# EAGLE design tomato-single-cell (EAGLE 7.4.0)
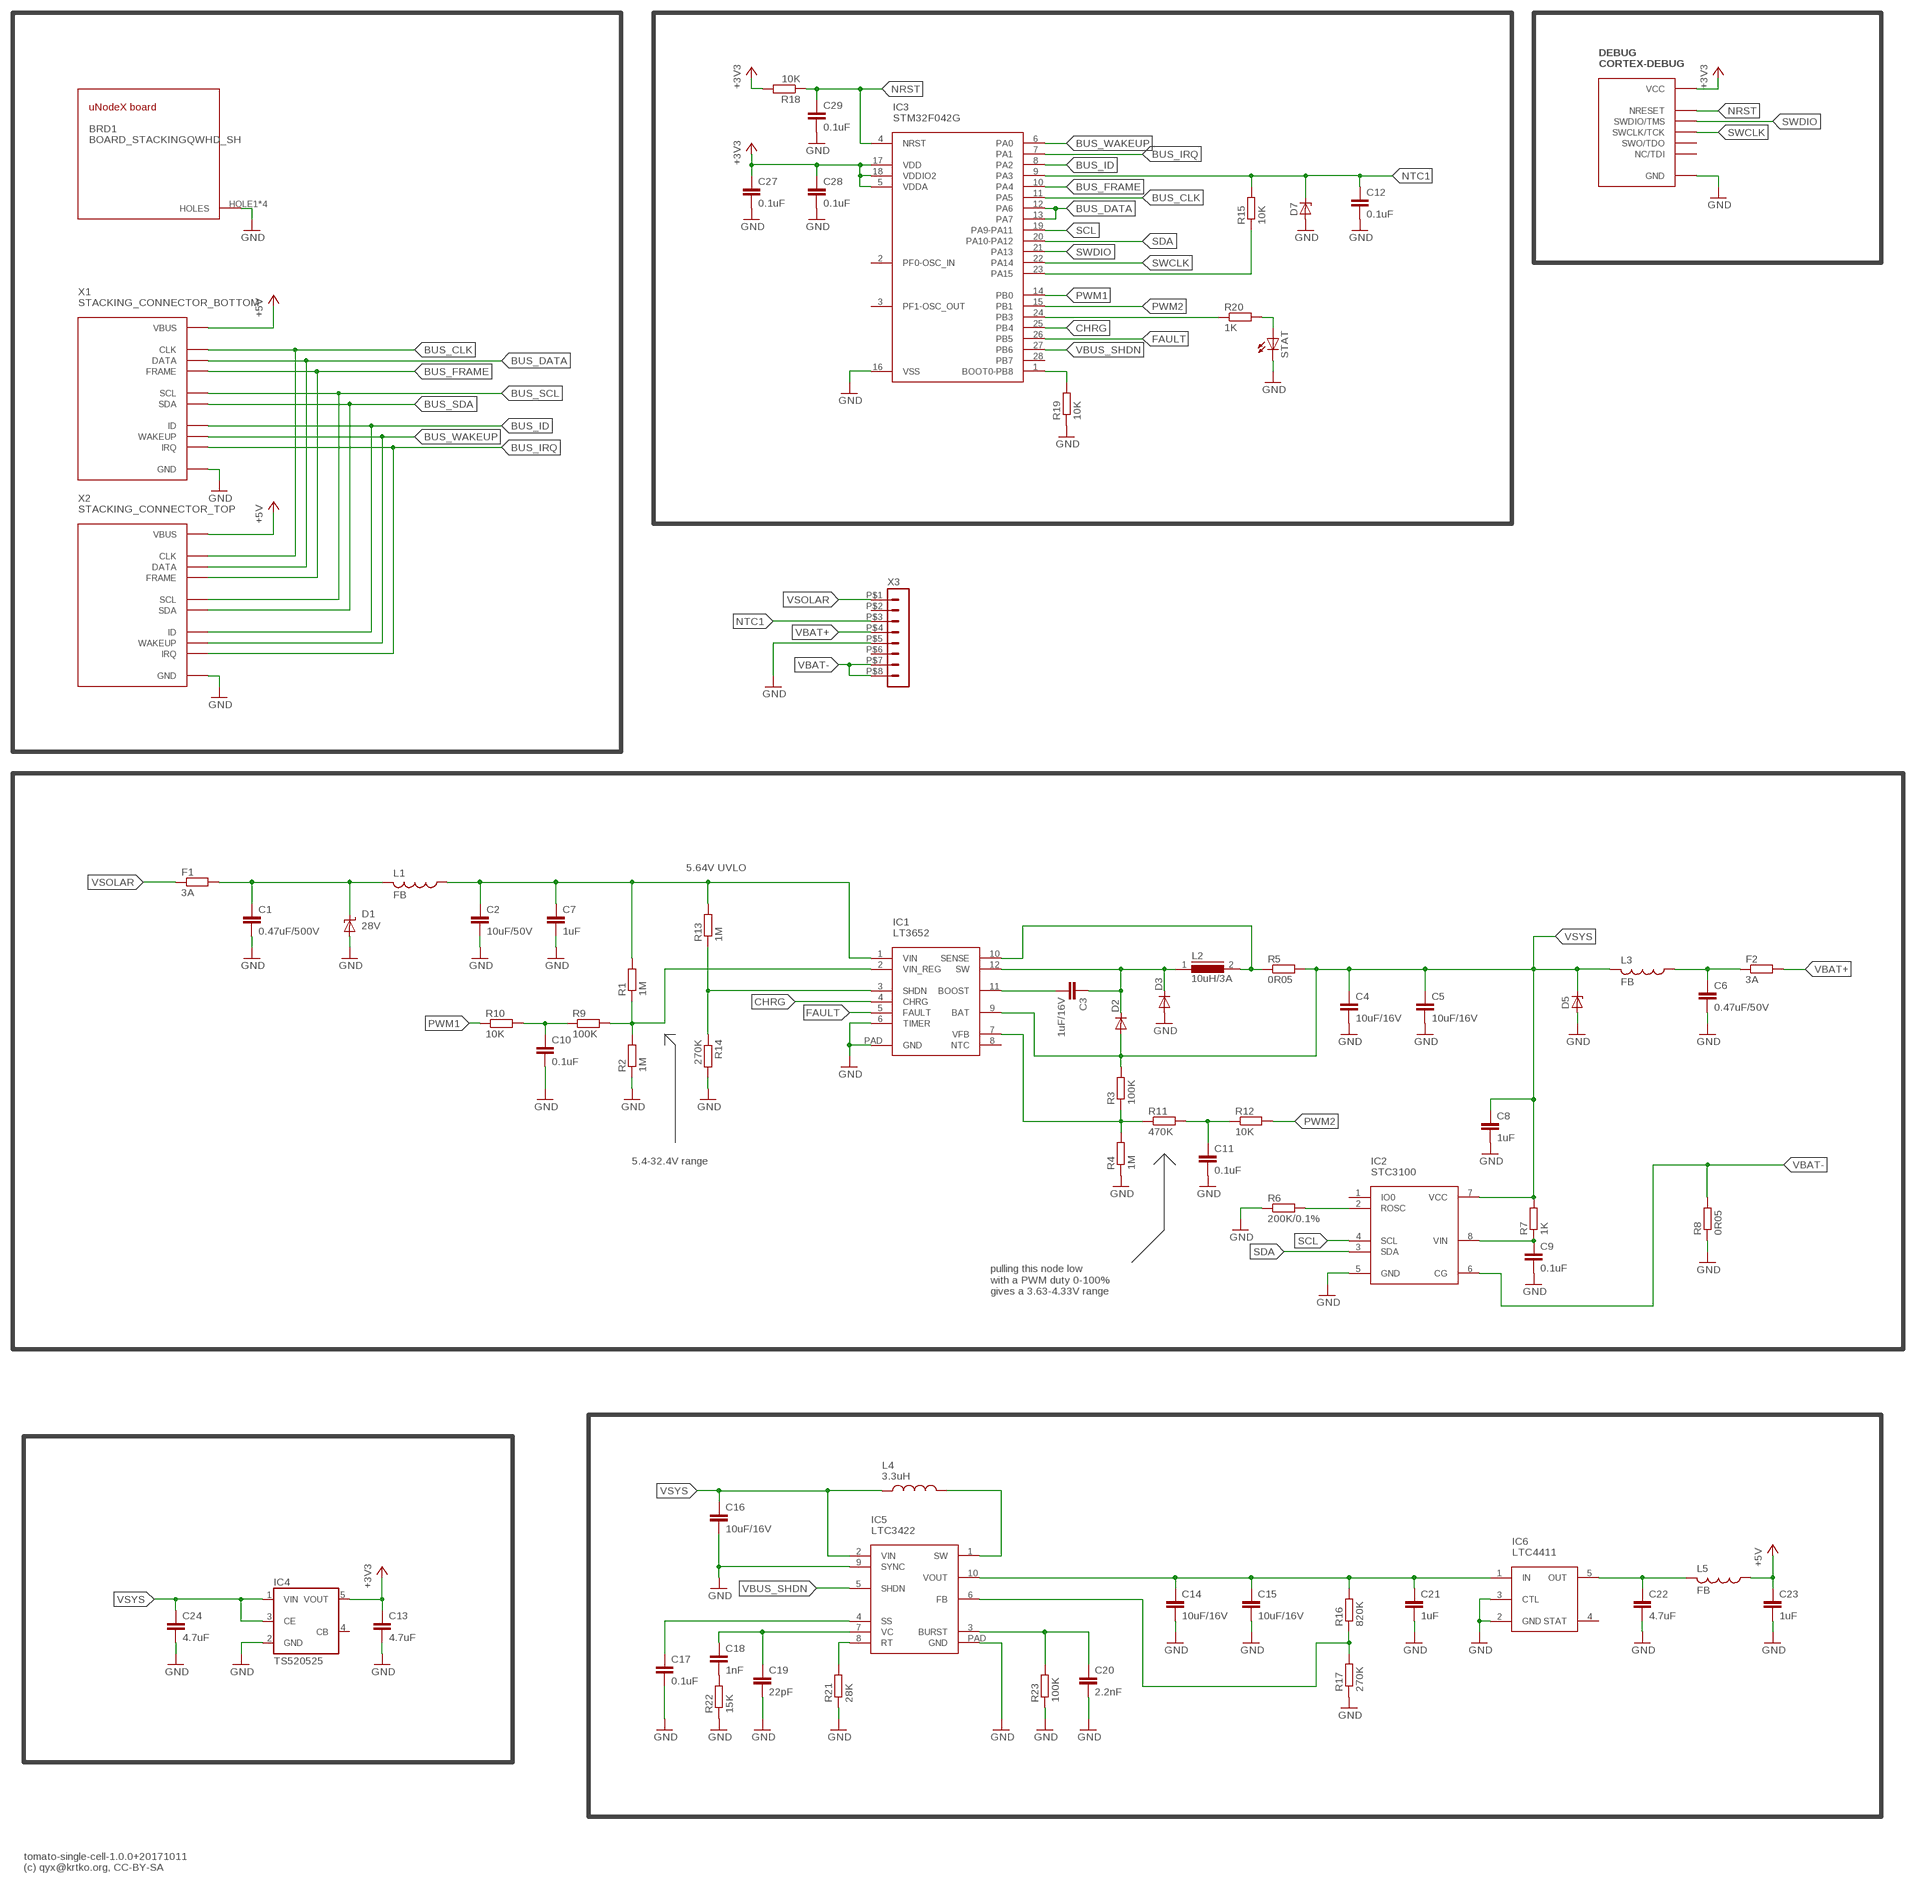
[diagram p0: schematic, sheet 1]

## Parts
BRD1  BOARD_STACKINGQWHD_SH  [QWHD_SHARP_CORNERS]
C1  0.47uF/500V  C-EUC1206  [C1206]
C2  10uF/50V  C-EUC2220K  [C2220K]
C3  1uF/16V  C-EUC0805  [C0805]
C4  10uF/16V  C-EUC1206  [C1206]
C5  10uF/16V  C-EUC1206  [C1206]
C6  0.47uF/50V  C-EUC0805  [C0805]
C7  1uF  C-EUC0805  [C0805]
C8  1uF  C-EUC0603  [C0603]
C9  0.1uF  C-EUC0603  [C0603]
C10  0.1uF  C-EUC0603  [C0603]
C11  0.1uF  C-EUC0603  [C0603]
C12  0.1uF  C-EUC0603  [C0603]
C13  4.7uF  C-EUC0805  [C0805]
C14  10uF/16V  C-EUC1206  [C1206]
C15  10uF/16V  C-EUC1206  [C1206]
C16  10uF/16V  C-EUC1206  [C1206]
C17  0.1uF  C-EUC0603  [C0603]
C18  1nF  C-EUC0603  [C0603]
C19  22pF  C-EUC0603  [C0603]
C20  2.2nF  C-EUC0603  [C0603]
C21  1uF  C-EUC0805  [C0805]
C22  4.7uF  C-EUC0805  [C0805]
C23  1uF  C-EUC0805  [C0805]
C24  4.7uF  C-EUC0805  [C0805]
C27  0.1uF  C-EUC0603  [C0603]
C28  0.1uF  C-EUC0603  [C0603]
C29  0.1uF  C-EUC0603  [C0603]
D1  28V  SUPPRESSOR-SMBJ  [SMBJ]
D2  DIODE-SOD323-W  [SOD323-W]
D3  DIODE-SOD323-W  [SOD323-W]
D5  ZENER-DIODESOT23  [SOT23]
D7  ZENER-DIODESOT23  [SOT23]
DEBUG  CORTEX-DEBUG  [CORTEX-DEBUG]
F1  3A  R-EU_R1206  [R1206]
F2  3A  R-EU_R1206  [R1206]
IC1  LT3652  [MSOP12-PAD]
IC2  STC3100  [MSOP8]
IC3  STM32F042G  [UFQFPN28]
IC4  TS520525  [SOT25]
IC5  LTC3422  [DFN10-3X3]
IC6  LTC4411  [SOT23-5]
L1  FB  L-USL3216C  [L3216C]
L2  10uH/3A  DR74  [DR74]
L3  FB  L-USL3216C  [L3216C]
L4  3.3uH  XAL50XX  [XAL50XX]
L5  FB  L-USL3216C  [L3216C]
R1  1M  R-EU_R0603  [R0603]
R2  1M  R-EU_R0603  [R0603]
R3  100K  R-EU_R0603  [R0603]
R4  1M  R-EU_R0603  [R0603]
R5  0R05  R-EU_R1206  [R1206]
R6  200K/0.1%  R-EU_R0603  [R0603]
R7  1K  R-EU_R0603  [R0603]
R8  0R05  R-EU_R1206  [R1206]
R9  100K  R-EU_R0603  [R0603]
R10  10K  R-EU_R0603  [R0603]
R11  470K  R-EU_R0603  [R0603]
R12  10K  R-EU_R0603  [R0603]
R13  1M  R-EU_R0603  [R0603]
R14  270K  R-EU_R0603  [R0603]
R15  10K  R-EU_R0603  [R0603]
R16  820K  R-EU_R0603  [R0603]
R17  270K  R-EU_R0603  [R0603]
R18  10K  R-EU_R0603  [R0603]
R19  10K  R-EU_R0603  [R0603]
R20  1K  R-EU_R0603  [R0603]
R21  28K  R-EU_R0603  [R0603]
R22  15K  R-EU_R0603  [R0603]
R23  100K  R-EU_R0603  [R0603]
STAT  LEDCHIPLED_0805  [CHIPLED_0805]
X1  STACKING_CONNECTOR_BOTTOM  [HAR-FLEX-BOTTOM-12P]
X2  STACKING_CONNECTOR_TOP  [HAR-FLEX-TOP-12P]
X3  HEADER_POS8_43045-0800  [43045-0800]

## Nets
+3V3: C13.1 C27.1 C28.1 DEBUG.VCC IC3.5(VDDA) IC3.17(VDD) IC3.18(VDDIO2) IC4.5(VOUT) R18.2
+5V: C23.1 L5.1 X1.VBUS X2.VBUS
BUS_CLK: IC3.11(PA5) X1.CLK X2.CLK
BUS_DATA: IC3.12(PA6) IC3.13(PA7) X1.DATA X2.DATA
BUS_FRAME: IC3.10(PA4) X1.FRAME X2.FRAME
BUS_ID: IC3.8(PA2) X1.ID X2.ID
BUS_IRQ: IC3.7(PA1) X1.IRQ X2.IRQ
BUS_SCL: X1.SCL X2.SCL
BUS_SDA: X1.SDA X2.SDA
BUS_WAKEUP: IC3.6(PA0) X1.WAKEUP X2.WAKEUP
CHRG: IC1.4(CHRG) IC3.25(PB4)
FAULT: IC1.5(FAULT) IC3.26(PB5)
GND: BRD1.HOLE1(HOLES) BRD1.HOLE2(HOLES) BRD1.HOLE3(HOLES) BRD1.HOLE4(HOLES) C1.2 C2.2 C4.2 C5.2 C6.2 C7.2 C8.2 C9.2 C10.2 C11.2 C12.2 C13.2 C14.2 C15.2 C16.2 C17.2 C19.2 C20.2 C21.2 C22.2 C23.2 C24.2 C27.2 C28.2 C29.2 D1.A D3.A D5.1(A) D7.1(A) DEBUG.GND1(GND) DEBUG.GND2(GND) DEBUG.GND_DETECT(GND) IC1.6(TIMER) IC1.PAD(GND) IC2.5(GND) IC3.16(VSS) IC4.2(GND) IC5.9(SYNC) IC5.PAD(GND) IC6.2(GND) IC6.3(CTL) R2.1 R4.1 R6.1 R8.1 R14.2 R17.1 R19.1 R21.1 R22.1 R23.1 STAT.C X1.GND1(GND) X1.GND2(GND) X1.GND3(GND) X1.H1(GND) X1.H2(GND) X1.H3(GND) X1.H4(GND) X2.GND1(GND) X2.GND2(GND) X2.GND3(GND) X2.H1(GND) X2.H2(GND) X2.H3(GND) X2.H4(GND) X3.P$5
N$1: C1.1 D1.C F1.2 L1.2
N$2: IC2.2(ROSC) R6.2
N$3: IC1.2(VIN_REG) R1.1 R2.2 R9.2
N$4: C9.1 IC2.8(VIN) R7.1
N$5: C10.1 R9.1 R10.2
N$6: C11.1 R11.2 R12.1
N$7: IC1.3(SHDN) R13.1 R14.1
N$8: C3.1 D2.C D3.C IC1.12(SW) L2.1
N$9: C17.1 IC5.4(SS)
N$10: C3.2 IC1.11(BOOST)
N$11: IC1.10(SENSE) L2.2 R5.1
N$12: IC1.7(VFB) R3.1 R4.2 R11.1
N$13: IC3.23(PA15) R15.1
N$14: IC3.24(PB3) R20.1
N$15: IC5.1(SW) L4.2
N$16: C14.1 C15.1 C21.1 IC5.10(VOUT) IC6.1(IN) R16.2
N$17: IC5.6(FB) R16.1 R17.2
N$18: IC5.8(RT) R21.2
N$19: C18.2 R22.2
N$20: C18.1 C19.1 IC5.7(VC)
N$21: C20.1 IC5.3(BURST) R23.2
N$23: C22.1 IC6.5(OUT) L5.2
N$33: IC3.1(BOOT0-PB8) R19.2
N$34: R20.2 STAT.A
NRST: C29.1 DEBUG.NRESET IC3.4(NRST) R18.1
NTC1: C12.1 D7.3(C) IC3.9(PA3) R15.2 X3.P$3
PWM1: IC3.14(PB0) R10.1
PWM2: IC3.15(PB1) R12.2
SCL: IC2.4(SCL) IC3.19(PA9-PA11)
SDA: IC2.3(SDA) IC3.20(PA10-PA12)
SWCLK: DEBUG.SWCLK/TCK IC3.22(PA14)
SWDIO: DEBUG.SWDIO/TMS IC3.21(PA13)
VBAT+: F2.2 X3.P$4
VBAT+PO: C6.1 F2.1 L3.1
VBAT-: IC2.6(CG) R8.2 X3.P$7 X3.P$8
VBUS_SHDN: IC3.27(PB6) IC5.5(SHDN)
VIN: C2.1 C7.1 IC1.1(VIN) L1.1 R1.2 R13.2
VSOLAR: F1.1 X3.P$1
VSYS: C4.1 C5.1 C8.1 C16.1 C24.1 D2.A D5.3(C) IC1.9(BAT) IC2.7(VCC) IC4.1(VIN) IC4.3(CE) IC5.2(VIN) L3.2 L4.1 R3.2 R5.2 R7.2
Unconnected: DEBUG.NC/TDI DEBUG.SWO/TDO IC1.8(NTC) IC2.1(IO0) IC3.2(PF0-OSC_IN) IC3.3(PF1-OSC_OUT) IC3.28(PB7) IC4.4(CB) IC6.4(STAT) X3.P$2 X3.P$6

## Notes on the sheet
- 5.64V UVLO
- 5.4-32.4V range
- pulling this node low
  with a PWM duty 0-100%
  gives a 3.63-4.33V range
- tomato-single-cell-1.0.0+20171011
- (c) qyx@krtko.org, CC-BY-SA

## Library data of the parts
BRD1 = unodex-boards:BOARD_STACKING
C1-C24 C27-C29 = rcl:C-EU: CAPACITOR, European symbol
D1 = diode:SUPPRESSOR-: Suppressor diode
D2 D3 = diode:DIODE-: DIODE
D5 D7 = diode:ZENER-DIODE: Z-Diode
DEBUG = debug-connectors:CORTEX-DEBUG
F1 F2 R1-R23 = rcl:R-EU_: RESISTOR, European symbol
IC1 = chargers:LT3652
IC2 = stc3100:STC3100
IC3 = stm32f042xx:STM32F042G
IC4 = v-reg:TS5205: 150mA Low Noise LDO Voltage Regulator with Enable TSC [Taiwan Semiconductor Company, Ltd] Source: http://www.taiwansemi.com .. 5205_0409c.pdf
IC5 = dc-dc-regulators:LTC3422
IC6 = ideal-diodes:LTC4411
L1 L3 L5 = rcl:L-US: INDUCTOR, American symbol
L2 = inductors:DR74: High Power Density, High Efficiency, Shielded Inductors Source: coiltronics_dr_series.pdf
L4 = smd-inductors:XAL50XX
STAT = led:LED: LED OSRAM: - CHIPLED LG R971, LG N971, LY N971, LG Q971, LY Q971, LO R971, LY R971 LH N974, LH R974 LS Q976, LO Q976, LY Q976 LO Q996 - Hyper CHIPLED LW Q18S LB Q993, LB Q99A, LB R99A - SideLED LS A670, LO A670, LY A670, LG A670, LP A670 LB A673, LV A673, LT A673, LW A673 LH A674 LY A675 LS A676, LA A676, LO A676, LY A676, LW A676 LS A679, LY A679, LG A679 - Hyper Micro SIDELED® LS Y876, LA Y876, LO Y876, LY Y876 LT Y87S - SmartLED LW L88C, LW L88S LB L89C, LB L89S, LG L890 LS L89K, LO L89K, LY L89K LS L896, LA L896, LO L896, LY L896 - TOPLED LS T670, LO T670, LY T670, LG T670, LP T670 LSG T670, LSP T670, LSY T670, LOP T670, LYG T670 LG T671, LOG T671, LSG T671 LB T673, LV T673, LT T673, LW T673 LH T674 LS T676, LA T676, LO T676, LY T676, LB T676, LH T676, LSB T676, LW T676 LB T67C, LV T67C, LT T67C, LS T67K, LO T67K, LY T67K, LW E67C LS E67B, LA E67B, LO E67B, LY E67B, LB E67C, LV E67C, LT E67C LW T67C LS T679, LY T679, LG T679 LS T770, LO T770, LY T770, LG T770, LP T770 LB T773, LV T773, LT T773, LW T773 LH T774 LS E675, LA E675, LY E675, LS T675 LS T776, LA T776, LO T776, LY T776, LB T776 LHGB T686 LT T68C, LB T68C - Hyper Mini TOPLED® LB M676 - Mini TOPLED Santana® LG M470 LS M47K, LO M47K, LY M47K Source: http://www.osram.convergy.de LUXEON: - LUMILED® LXK2-PW12-R00, LXK2-PW12-S00, LXK2-PW14-U00, LXK2-PW14-V00 LXK2-PM12-R00, LXK2-PM12-S00, LXK2-PM14-U00 LXK2-PE12-Q00, LXK2-PE12-R00, LXK2-PE12-S00, LXK2-PE14-T00, LXK2-PE14-U00 LXK2-PB12-K00, LXK2-PB12-L00, LXK2-PB12-M00, LXK2-PB14-N00, LXK2-PB14-P00, LXK2-PB14-Q00 LXK2-PR12-L00, LXK2-PR12-M00, LXK2-PR14-Q00, LXK2-PR14-R00 LXK2-PD12-Q00, LXK2-PD12-R00, LXK2-PD12-S00 LXK2-PH12-R00, LXK2-PH12-S00 LXK2-PL12-P00, LXK2-PL12-Q00, LXK2-PL12-R00 Source: www.luxeon.com KINGBRIGHT: KA-3528ASYC Source: www.kingbright.com
X1 = unodex-boards:STACKING_CONNECTOR_BOTTOM
X2 = unodex-boards:STACKING_CONNECTOR_TOP
X3 = con-molex-micro-fit-3_0:HEADER_POS8_?: Molex - Micro-Fit 3.0 Series connector, 3.00mm (0.118") pitch header, 8 positions.

## Net classes
0 default: width 0.2 mm, drill 0.3 mm, clearance 0.15 mm

## Board
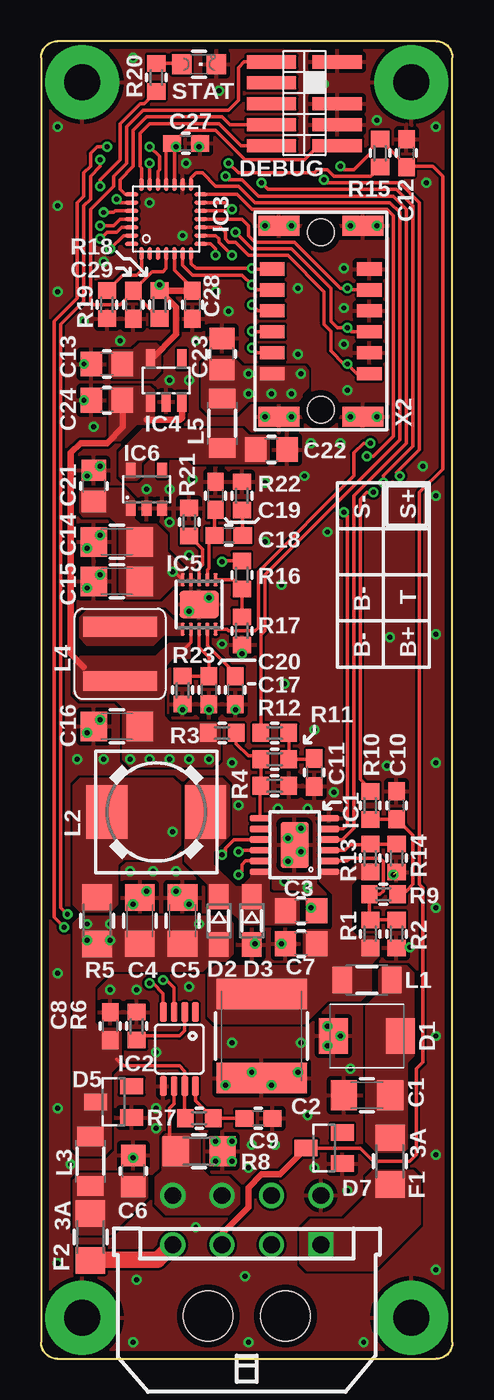
[diagram p1: board, top side]
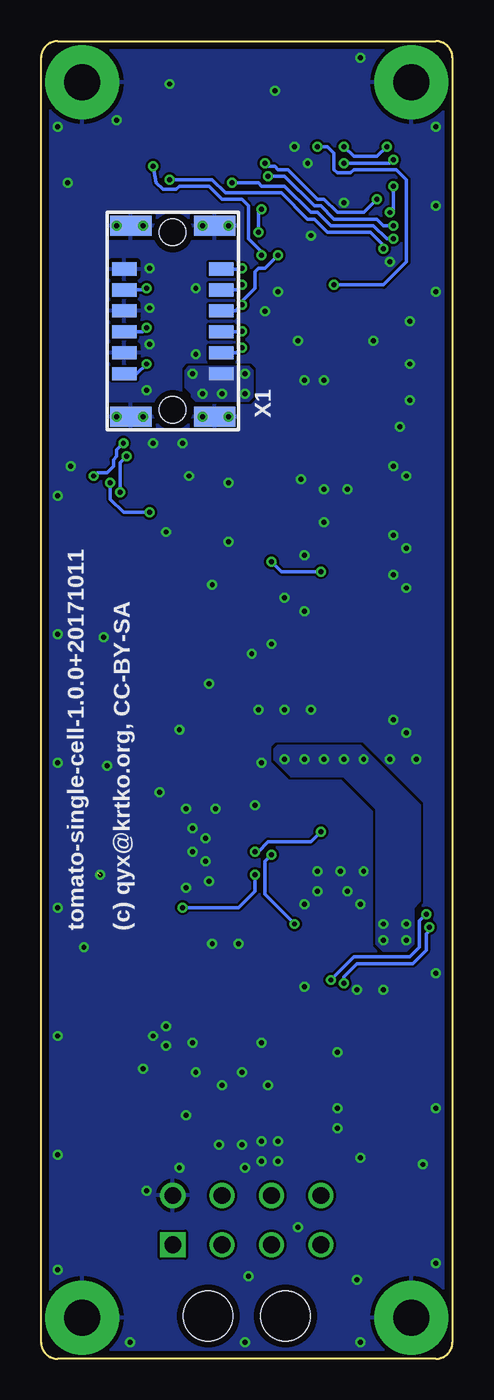
[diagram p2: board, bottom side, seen from below]

Size 25 x 80 mm. Coordinates in mm from the lower left corner, seen from the top.
Copper layers (1*16): Top 0.035mm / dielectric 1.5mm / Bottom 0.035mm
Design rules "seeed *": minimum track width 0.2mm, minimum drill 0.3mm, track to track 0.15mm, track to pad 0.15mm, pad to pad 0.15mm, via to via 0.15mm, smd to smd 0mil, copper to edge 0.4mm, drill to drill 0.4mm, minimum pad ring 6mil, minimum via ring 6mil, stop-mask expansion 2mil, vias tented up to drill 0.5mm, thermal gap 10mil

### Footprints (pad centres in the part's own frame; a part is rotated, then mirrored left to right if it is on the bottom)
QWHD_SHARP_CORNERS = drill 2.2 pad 4.5: HOLE1 2.5,2.5; HOLE2 22.5,2.5; HOLE3 22.5,77.5; HOLE4 2.5,77.5
C1206 = smd 1.6 x 1.8: 1 -1.4,0; 2 1.4,0
C2220K = smd 1.85 x 5.5: 1 -2.55,0; 2 2.55,0
C0805 = smd 1.3 x 1.5: 1 -0.95,0; 2 0.95,0
C0603 = smd 1.1 x 1: 1 -0.85,0; 2 0.85,0
SMBJ = smd 1.78 x 2.16: A 2.04,0; C -2.03,0
SOD323-W = smd 1.5 x 1.2: A 1.45,0; C -1.45,0
SOT23 = smd 1 x 1.4: 1 -0.95,-1.1; 2 0.95,-1.1; 3 0,1.1
CORTEX-DEBUG = smd 0.8 x 3: GND1 -1.27,-2; GND2 0,-2; GND_DETECT 2.54,-2; NC/TDI 1.27,2; NRESET 2.54,2; SWCLK/TCK -1.27,2; SWDIO/TMS -2.54,2; SWO/TDO 0,2; VCC -2.54,-2
R1206 = smd 1.6 x 1.803: 1 -1.422,0; 2 1.422,0
MSOP12-PAD = smd 0.4 x 1.2: 1 -1.625,-2.1; 2 -0.975,-2.1; 3 -0.325,-2.1; 4 0.325,-2.1; 5 0.975,-2.1; 6 1.625,-2.1; 7 1.625,2.1; 8 0.975,2.1; 9 0.325,2.1; 10 -0.325,2.1; 11 -0.975,2.1; 12 -1.625,2.1 | smd 2.8 x 1.7: PAD 0,0
MSOP8 = smd 0.4 x 1.2: 1 -0.975,-2.25; 2 -0.325,-2.25; 3 0.325,-2.25; 4 0.975,-2.25; 5 0.975,2.25; 6 0.325,2.25; 7 -0.325,2.25; 8 -0.975,2.25
UFQFPN28 = smd 0.8 x 0.25: 1 -2.1,1.5; 2 -2.1,1; 3 -2.1,0.5; 4 -2.1,0; 5 -2.1,-0.5; 6 -2.1,-1; 7 -2.1,-1.5; 15 2.1,-1.5; 16 2.1,-1; 17 2.1,-0.5; 18 2.1,0; 19 2.1,0.5; 20 2.1,1; 21 2.1,1.5 | smd 0.25 x 0.8: 8 -1.5,-2.1; 9 -1,-2.1; 10 -0.5,-2.1; 11 0,-2.1; 12 0.5,-2.1; 13 1,-2.1; 14 1.5,-2.1; 22 1.5,2.1; 23 1,2.1; 24 0.5,2.1; 25 0,2.1; 26 -0.5,2.1; 27 -1,2.1; 28 -1.5,2.1
SOT25 = smd 0.55 x 1.2: 1 -0.95,-1.3; 2 0,-1.3; 3 0.95,-1.3; 4 0.95,1.3; 5 -0.95,1.3
DFN10-3X3 = smd 0.25 x 0.8: 1 -1,-1.5; 2 -0.5,-1.5; 3 0,-1.5; 4 0.5,-1.5; 5 1,-1.5; 6 1,1.5; 7 0.5,1.5; 8 0,1.5; 9 -0.5,1.5; 10 -1,1.5 | smd 2.38 x 1.65: PAD 0,0
SOT23-5 = smd 0.6 x 0.9: 1 -0.95,-1.15; 2 0,-1.15; 3 0.95,-1.15; 4 0.95,1.15; 5 -0.95,1.15
L3216C = smd 1.2 x 1.6: 1 -1.5,0; 2 1.5,0
DR74 = smd 2.5 x 3.25: 1 -3,0; 2 3,0
XAL50XX = smd 1.2 x 4.5: 1 -1.65,0; 2 1.65,0
R0603 = smd 1 x 1.1: 1 -0.85,0; 2 0.85,0
CHIPLED_0805 = smd 1.2 x 1.2: A 0,-1.05; C 0,1.05
HAR-FLEX-BOTTOM-12P = smd 1.5 x 0.8 bottom: CLK -5.05,-15.105; DATA -5.05,-17.645; FRAME -5.05,-20.185; GND1 -5.05,-13.835; GND2 -5.05,-16.375; GND3 -5.05,-18.915; ID -10.95,-16.375; IRQ -10.95,-13.835; SCL -10.95,-17.645; SDA -10.95,-18.915; VBUS -10.95,-20.185; WAKEUP -10.95,-15.105 | smd 2.5 x 1.2 bottom: H1 -10.55,-22.8; H2 -5.45,-22.8; H3 -5.45,-11.2; H4 -10.55,-11.2 | hole 1.6: -8,-11.615; -8,-22.385
HAR-FLEX-TOP-12P = smd 1.5 x 0.8: CLK -5.05,-15.105; DATA -5.05,-17.645; FRAME -5.05,-20.185; GND1 -5.05,-13.835; GND2 -5.05,-16.375; GND3 -5.05,-18.915; ID -10.95,-16.375; IRQ -10.95,-13.835; SCL -10.95,-17.645; SDA -10.95,-18.915; VBUS -10.95,-20.185; WAKEUP -10.95,-15.105 | smd 2.5 x 1.2: H1 -10.55,-22.8; H2 -5.45,-22.8; H3 -5.45,-11.2; H4 -10.55,-11.2 | hole 1.6: -8,-11.615; -8,-22.385
43045-0800 = drill 1.02 square: P$1 4.5,4.32 | drill 1.02: P$2 1.5,4.32; P$3 -1.5,4.32; P$4 -4.5,4.32; P$5 4.5,7.32; P$6 1.5,7.32; P$7 -1.5,7.32; P$8 -4.5,7.32 | hole 3: 2.35,0; -2.35,0

### Placement (x,y rotation side)
BRD1  0,0 0 top
C1  19.8,16 180 top
C2  13.4,19.6 270 top
C3  15.8,27.2 0 top
C4  6,26.6 90 top
C5  8.6,26.6 90 top
C6  5.6,11.4 90 top
C7  15.8,25.2 180 top
C8  4.2,20.2 90 top
C9  13.2,14.6 0 top
C10  21.6,33.6 90 top
C11  16.6,35.6 270 top
C12  22.2,73.2 90 top
C13  4,60.4 180 top
C14  4.6,49.6 180 top
C15  4.6,47.2 180 top
C16  4.6,38.4 180 top
C17  11.8,40.6 270 top
C18  11.4,50 0 top
C19  10.6,52.4 90 top
C20  10.2,40.6 270 top
C21  3.2,53 90 top
C22  14,55.2 0 top
C23  11,61 90 top
C24  4,58.2 180 top
C27  8.8,73.8 0 top
C28  9.2,64 270 top
C29  5.6,64 270 top
D1  19.8,19.6 180 top
D2  10.8,26.6 270 top
D3  12.8,26.6 270 top
D5  4.4,15.6 90 top
D7  17.2,12.8 90 top
DEBUG  16,76.2 90 top
F1  21.2,12 90 top
F2  3,7.4 270 top
IC1  15.4,31.2 90 top
IC2  8.4,18.8 180 top
IC3  7.6,69.2 90 top
IC4  7.6,59.4 0 top
IC5  9.6,45.8 0 top
IC6  6.4,52.8 0 top
L1  19.8,23 0 top
L2  7,33.2 180 top
L3  3,12 90 top
L4  4.8,42.8 90 top
L5  11,56.8 270 top
R1  20,25.8 270 top
R2  21.6,25.8 90 top
R3  11,38 180 top
R4  14.2,34.8 180 top
R5  3.4,26.6 270 top
R6  5.8,20.2 270 top
R7  9.6,14.6 180 top
R8  9.6,12.6 180 top
R9  20.8,28.2 180 top
R10  20,33.6 270 top
R11  14.2,36.4 0 top
R12  14.2,38 180 top
R13  20,30.4 270 top
R14  21.6,30.4 270 top
R15  20.6,73.2 90 top
R16  12.2,47.6 90 top
R17  12.2,44.2 90 top
R18  7.2,64 90 top
R19  4,64 90 top
R20  7,77.8 90 top
R21  9,50.8 270 top
R22  12.2,52.4 270 top
R23  8.6,40.6 90 top
STAT  9.6,78.6 270 top
X1  25,80 0 top
X2  25,80 0 top
X3  12.5,2.6 0 top

### Tracks (layer width: path | path; a pad name or v marks a point on that pad's centre or on a via)
+3V3  (via drill 0.3)
  Top 0.2: IC3.5 8.1,66.1 9.2,65 C28.1 | IC3.18 7.6,73.45 C27.1 | IC3.17 8.1,73.65 | 8.1,73.65 C27.1 | C27.1 8,73.8 8.8,74.6 10.6,74.6 12.4,72.8 16,72.8 16.86,73.66 DEBUG.VCC | 8.1,73.65 8.15,73.65 v8.2,73.6 | v7.2,65.2 R18.2
  Top 0.4: IC4.5 6.7,60.7 8.2,62.2 8.2,63.85 R18.2 C28.1
  Bottom 0.2: v8.2,73.6 7.6,73.6 7.2,73.2 7.2,72.2 7,72 6.2,72 6,72.2 3.4,72.2 2.8,71.6 2.8,66.6 4.2,65.2 v7.2,65.2
  pour Top (no thermals): 4.4,61.2 5.6,61.2 6,61.6 7,61.6 7.2,61.4 7.2,60 6.8,59.6 4.4,59.6 4.2,59.8 4.2,61
+5V  (via drill 0.3)
  other vias: 12.6,59.8 12.6,58.6 15.8,59.8 15.2,58.6 14,58.6
  pour Top (no thermals): 12.2,60.2 16,60.2 16.2,60 16.2,59 15.8,58.6 15.8,58.4 15.6,58.2 12.6,58.2 11.8,57.4 10.2,57.4 9.8,57.8 9.8,60.4 10.2,60.8 11.6,60.8
  pour Bottom (no thermals): 12.4,60.2 16,60.2 16.2,60 16.2,59 15.8,58.6 15.8,58.4 15.6,58.2 12.4,58.2 12.2,58.4 12.2,60
BUS_CLK  (via drill 0.3)
  Top 0.2: X2.CLK 18.7,64.89 v18.6,65 18.2,65 15.4,67.8 13,67.8 12.6,68.2 12.6,68.8 12.2,69.2 IC3.11
  Bottom 0.2: X2.CLK 18.7,64.89 v18.6,65
BUS_DATA  (via drill 0.3)
  Top 0.2: X2.DATA 18.84,62.35 v18.6,62.6 18,62.6 17.6,63 17.6,65 15.2,67.4 12.8,67.4 v11.8,68.4 | IC3.12 11.5,69.7 v11.6,69.8 11.2,70.2 IC3.13
  Bottom 0.2: X2.DATA 18.84,62.35 v18.6,62.6 | v11.8,68.4 11.8,69.6 v11.6,69.8
BUS_FRAME  (via drill 0.3)
  Top 0.2: X2.FRAME 19.18,59.81 v18.6,60.4 18.4,60.4 17.6,61.2 17.6,62.4 17.2,62.8 17.2,64.8 15,67 12.6,67 11.8,67.8 11.4,67.8 11.2,68 11.2,68.4 10.9,68.7 IC3.10
  Bottom 0.2: X2.FRAME 19.18,59.81 v18.6,60.4
BUS_ID  (via drill 0.3)
  Top 0.2: X2.ID 13.18,63.62 v12.8,64 | IC3.8 10.3,67.7 10.6,67.4 v10.6,67
  Bottom 0.2: X2.ID 13.18,63.62 v12.8,64 12.8,64.2 12,65 12,66 11.8,66.2 11.4,66.2 v10.6,67
BUS_IRQ  (via drill 0.3)
  Top 0.2: X2.IRQ 12.84,66.17 v12.8,66.2 9.4,66.2 9.1,66.5 IC3.7
  Bottom 0.2: X2.IRQ 12.84,66.17 v12.8,66.2
BUS_SCL  (via drill 0.3)
  Top 0.2: X2.SCL 12.85,62.35 v12.8,62.4
  Bottom 0.2: X2.SCL 12.85,62.35 v12.8,62.4
BUS_SDA  (via drill 0.3)
  Top 0.2: X2.SDA 13.12,61.09 v12.8,61.4
  Bottom 0.2: X2.SDA 13.12,61.09 v12.8,61.4
BUS_WAKEUP  (via drill 0.3)
  Top 0.2: X2.WAKEUP 13.11,64.89 v12.8,65.2 12.2,65.8 9.2,65.8 8.6,66.4 IC3.6
  Bottom 0.2: X2.WAKEUP 13.11,64.89 v12.8,65.2
CHRG  (via drill 0.3)
  Top 0.2: IC1.4 18.32,31.52 19,32.2 19,52.4 22.2,55.6 22.2,69.8 21.4,70.6 13.2,70.6 12.2,71.6 11.4,71.6 v11.2,71.8 | IC3.25 4.8,69.2 4.4,68.8 v3.6,68.8
  Bottom 0.2: v11.2,71.8 10.2,71.8 8.4,70 8,70 7.2,69.2 4.6,69.2 4.2,68.8 v3.6,68.8
FAULT  (via drill 0.3)
  Top 0.2: IC1.5 18.38,32.17 18.6,32.4 18.6,51.2 v18.4,51.4 | IC3.26 4.9,68.7 4.6,68.4 4,68.4 v3.6,68 | v13.4,71.4 13.8,71 21.6,71 22.6,70 22.6,55.4 20.8,53.6 v20.8,53.2
  Bottom 0.2: v13.4,71.4 11.8,71.4 11.6,71.2 10.2,71.2 8.6,69.6 8.2,69.6 7.4,68.8 4.8,68.8 4,68 v3.6,68 | v20.8,53.2 20.8,52.2 20,51.4 v18.4,51.4
GND  (via drill 0.3)  (1 unrouted)
  other vias: 5.6,1 12.6,1 19.6,1 1,5.8 24,5.4 24,12.4 24,19.6 1,15.2 1,23.4 24,27.4 24,36.2 24,44 24,52.4 2.6,58.2 1,64.8 1,74.8 24,74.8 15.2,68.8 13.6,68.8 18.8,68.8 20.4,68.8 15.2,57.2 13.6,57.2 18.8,57.2 20.4,57.2 21.4,29.4 18.4,66.2 18.4,63.8 18.4,61.6 8.8,72.6 9.6,73.6 10.8,77 17.2,77.4 20.4,75.2 3.8,66.6 2.6,63 4.8,61.8 9.4,61.8 10.6,64.8 11.4,63.6 5.6,79 15,30.2 15.8,30.8 15,31.6 15.8,32.2 14.4,33.4 16.2,33.4 17.8,34.4 18.6,10.2 12.6,11.6 12.8,13 14.2,13 16.2,14.8 11.2,16.6 12.8,17.4 14,16.6 15.6,17.4 7,18.6 7,14 7,15.2 5.8,4.8 1.8,11.8 9.4,8 12.4,5 17.4,20.2 18.2,19.6 17.4,19 18.8,17.6 11.6,19.2 15.8,19.2 14.6,25.2 13,25.2 9,22.6 4.2,22.4 5.8,22.4 5.6,27.6 6.4,28.4 8.2,28.4 9,27.6 5.4,29.6 6.8,29.6 8.2,29.6 8.6,39.4 10.2,39.4 11.8,39.4 12,33.6 11.6,36.2 16.6,38.2 14.8,41 21,36 3.8,36.4 2.8,38 3.6,50 2.8,49.2 3.6,47.6 2.8,46.8 9,45.4 10.2,46.2 9,48.8 7.8,50.8 6.4,52.8 7.8,52.8 9.2,53.4 13.6,53.2 16.4,55.6 16,53.6 2.8,53.6 3.6,54.2 7.8,59.4 9,59.4 3.2,56.6 3.6,38.8 2.2,36.4 2.6,60.4 1,70 11,43.4 12.2,42.8 14.8,29 16.2,28.6 22.4,25 18.6,58.8 15.6,61 15.6,65 18.2,55.6 8.6,68.2 6.6,70.2 23.4,71.4 23.2,54.2 21.2,43.8 13.6,49.6 17.4,50.2 14.6,47 16.6,11.6 5.6,12.2 10.6,12 10.6,13.2 11.6,13.2 11.6,12
  pour Top (rank 2): 0,0 25,0 25,80 0,80
  pour Bottom (rank 2): 0,0 25,0 25,80 0,80
N$1
  pour Top (no thermals): 22.2,14.4 22.2,18 22.6,18.4 22.6,23.4 22.2,23.8 20.8,23.8 20.6,23.6 20.6,22.2 19.8,21.4 19.8,13.2 20.4,12.6 22,12.6 22.2,12.8
N$2
  Top 0.2: IC2.2 8.72,19.93 8.4,19.6 6.05,19.6 R6.2
N$3
  Top 0.2: IC1.2 18.62,30.23 18.8,30.4 20.6,30.4 20.8,30.2 20.8,28.4 20.6,28.2 R9.2 19.95,26.7 R1.1 R2.2
N$4
  Top 0.2: IC2.8 9.38,15.68 R7.1 C9.1
N$5
  Top 0.2: R9.1 21.85,28.4 22.2,28.4 22.6,28.8 22.6,31.8 21.65,32.75 C10.1 R10.2
N$6
  Top 0.2: C11.1 16.55,36.4 R11.2 R12.1
N$7
  Top 0.2: IC1.3 18.48,30.88 18.8,31.2 19.95,31.2 R13.1 R14.1
N$8
  pour Top (no thermals): 13.8,28.4 13.8,29.6 12.8,29.6 12.8,29.2 12.2,28.6 11.8,28.6 10.4,30 10.4,30.8 11.4,31.8 11.4,34.8 11,35.2 9.2,35.2 8.8,34.8 8.8,30.2 10.2,28.8 10.2,27.6 10.4,27.4 11.4,27.4 12.4,26.4 15.4,26.4 15.6,26.6 15.6,28 15.4,28.2 14,28.2
N$9
  Top 0.2: IC5.4 10.1,43.3 11.8,41.6 C17.1
N$10  (via drill 0.3)
  Top 0.2: v16.4,27.4 16.55,27.2 C3.2 | IC1.11 12.43,30.23 12.2,30 12.2,29.6 v12,29.4
  Bottom 0.2: v12,29.4 12,28.4 13,27.4 v16.4,27.4
N$11  (via drill 0.3)
  Top 0.2: IC1.10 12.07,30.88 v12,30.8
  Bottom 0.2: v12,30.8 11.8,30.8 11.2,31.4 8.6,31.4 v8,32
  pour Top (no thermals): 2,29.6 2,27.6 2.4,27.2 4.2,27.2 4.6,27.6 4.6,30 5,30.4 7.6,30.4 8.4,31.2 8.4,34.8 8,35.2 2.4,35.2 2,34.8
N$12
  Top 0.2: R3.1 11.85,37.35 12.6,36.6 13.15,36.6 R11.1 R4.2 13.3,34.75 IC1.7
N$13  (via drill 0.3)
  Top 0.2: IC3.23 4.8,70.2 v4.6,70.4 | v11.4,72.6 12,72 16.6,72 16.8,72.2 17.4,72.2 17.8,71.8 20.05,71.8 R15.1
  Bottom 0.2: v4.6,70.4 5.4,69.6 7,69.6 7.8,70.4 8.2,70.4 10,72.2 10.6,72.2 10.8,72.4 11.2,72.4 v11.4,72.6
N$14  (via drill 0.3)
  Top 0.2: IC3.24 4.5,69.7 4.4,69.6 v3.8,69.6 | v3.6,71.2 3.6,71.6 4.8,72.8 4.8,75 6,76.2 6.25,76.2 R20.1
  Bottom 0.2: v3.8,69.6 3.6,69.8 v3.6,71.2
N$15
  pour Top (no thermals): 2.8,43.4 6.8,43.4 7.4,44 8.6,44 8.6,44.6 8.2,44.6 7.4,45.4 2.8,45.4 2.4,45 2.4,43.8
N$16  (via drill 0.3)
  Top 0.2: R16.2 11.05,48.45 v11,48.4 | v8,47.8 8.1,47.8 IC5.10
  Bottom 0.2: v11,48.4 10.4,47.8 v8,47.8
  pour Top (no thermals): 3.2,52.8 5,52.8 5.6,52.2 5.6,51 6,50.6 7,50.6 7.6,50 7.6,49 8.6,48 8.6,47 8,47 7.2,46.2 5.2,46.2 4.8,46.6 4.8,50.6 4.2,51.2 2.6,51.2 2.4,51.4 2.4,52.6 2.6,52.8
N$17
  Top 0.2: IC5.6 11.65,47.3 R16.1 R17.2
N$18
  Top 0.2: IC5.8 9.6,48 9.8,48.2 9.8,49.15 R21.2
N$19
  Top 0.2: C18.2 12.25,51.5 R22.2
N$20
  Top 0.2: IC5.7 10.1,47.9 10.2,48 10.2,49.65 C18.1 10.55,51.5 C19.1
N$21
  Top 0.2: IC5.3 9.6,43.2 10.2,42.6 C20.1 R23.2
N$23
  pour Top (no thermals): 7,54.8 9,54.8 9.4,54.4 13.6,54.4 13.8,54.6 13.8,55.8 13.6,56 12.6,56 12.2,56.4 6.2,56.4 4.8,55 4.8,53.6 5,53.4 5.8,53.4 6,53.6 6,54.4 6.4,54.8
N$33
  Top 0.2: IC3.1 6.1,66.1 5.8,65.8 4.95,65.8 R19.2
N$34
  Top 0.2: R20.2 8.5,78.65 STAT.A
NRST
  Top 0.2: C29.1 5.6,64.75 R18.1 | IC3.4 7.6,66.2 7.4,66 6.75,66 C29.1 | DEBUG.NRESET 12.34,78.74 12,78.4 12,76.4 11.4,75.8 6.2,75.8 5.2,74.8 5.2,72.6 4.4,71.8 4.4,71.2 3,69.8 3,64.2 3.2,64 4.8,64 5.6,64.8 C29.1
NTC1  (via drill 0.3)
  Top 0.2: IC3.9 10.6,68.2 10.8,68 10.8,67.8 v11.6,67 | D7.3 19.4,12.8 20.2,12 22.4,12 22.8,12.4 22.8,17.6 23.2,18 23.2,28.6 23,28.8 23,52.6 24.4,54 24.4,71.8 23.8,72.4 22.25,72.4 C12.1 22.2,72.45 R15.2 20,73.45 20,73.2 19,72.2 18.4,72.2 v18.2,72.4
  Top 0.4: X3.P$3 11,7.6 12.6,9.2 12.6,10.4 13.4,11.2 14.5,11.2 D7.3
  Bottom 0.2: v11.6,67 11.6,67.2 12.4,68 12.4,70 12.8,70.4 14,70.4 14.8,71.2 16.6,71.2 16.8,71 17.6,71 18,71.4 v18.2,72.4
PWM1  (via drill 0.3)
  Top 0.2: IC3.14 11.9,70.7 12.8,69.8 21,69.8 21.4,69.4 21.4,56 20.2,54.8 v19.8,54.8 | R10.1 20,34.6 19.4,35.2 19.4,52.2 19.8,52.6 v20.2,52.6
  Bottom 0.2: v20.2,52.6 20.2,54.4 v19.8,54.8
PWM2
  Top 0.2: IC3.15 9.1,71.7 9.4,72 9.8,72 10.6,71.2 12,71.2 13,70.2 21.2,70.2 21.8,69.6 21.8,55.8 13.6,47.6 13.6,44.2 13.35,43.95 R12.2
SCL  (via drill 0.3)
  Top 0.2: IC3.19 7.1,72.1 7.2,72.2 7.2,73 v6.6,73.6 | v4,73.6 3.4,73.6 3,73.2 3,72.4 2.6,72 2.6,70.6 2.2,70.2 2.2,64.4 0.8,63 0.8,26.8 v1.4,26.2 | IC2.4 7.42,22.18 6.8,22.8 v6.6,22.8
  Bottom 0.2: v6.6,73.6 6,73 4.6,73 v4,73.6 | v1.4,26.2 1.4,26 1.6,25.8 1.6,24.8 2.4,24 5.8,24 6.6,23.2 v6.6,22.8
SDA  (via drill 0.3)
  Top 0.2: IC3.20 v6.6,72.6 | v3.6,72.8 3.6,72.4 3,71.8 3,70.4 2.6,70 2.6,64.2 1.2,62.8 1.2,27.4 v1.6,27 | IC2.3 8.07,22.52 7.6,23 v7.4,23
  Bottom 0.2: v6.6,72.6 3.8,72.6 v3.6,72.8 | v1.6,27 2,26.6 2,25 2.6,24.4 6,24.4 v7.4,23
SWCLK
  Top 0.2: IC3.22 5.1,70.7 4.8,71 4.8,71.6 5.6,72.4 5.6,74.6 6.4,75.4 11,75.4 11.47,74.93 DEBUG.SWCLK/TCK
SWDIO
  Top 0.2: IC3.21 6.1,72.3 6,72.4 6,74.4 6.6,75 10.8,75 12.14,73.66 DEBUG.SWDIO/TMS
VBAT+
  Top 1: F2.2 3.02,6 7.08,6 X3.P$4
VBAT+PO
  pour Top (no thermals): 2,7.8 2.2,7.6 4.2,7.6 6.4,9.8 6.4,11 6.2,11.2 2.4,11.2 2,10.8
VBAT-
  Top 0.2: IC2.6 8.07,15.47 7.8,15.2 7.8,12.98 R8.2
  pour Top (no thermals): 7.6,13.6 9.4,13.6 9.6,13.4 9.6,11.6 10.2,11 11.4,11 12,10.4 12,9.4 11.4,8.8 7.6,8.8 7,9.4 7,11 7.4,11.4 7.4,13.4
VBUS_SHDN  (via drill 0.3)
  Top 0.2: IC5.5 11.3,44.3 11.4,44.2 13,44.2 13.2,44.4 13.2,47.8 19,53.6 19,55 19.6,55.6 v20,55.6 | v4.2,67.4 5,68.2 IC3.27 | v17.2,71.6 17.4,71.4 21.8,71.4 23,70.2 23,55.2 21.6,53.8 v21.8,53.6
  Bottom 0.2: v17.2,71.6 14.6,71.6 13.8,70.8 10.4,70.8 8.8,69.2 8.4,69.2 7.6,68.4 5,68.4 4.2,67.6 v4.2,67.4 | v20,55.6 20.4,55.2 20.4,54.8 20.6,54.6 20.6,54.2 21,53.8 21.6,53.8 v21.8,53.6
VIN
  pour Top (no thermals): 10.6,20.4 16,20.4 17.4,21.8 19.4,21.8 20,22.4 20,24 20.4,24.4 20.4,25.4 20.2,25.6 19.2,25.6 18.8,26 18.8,28.8 19.2,29.2 20.2,29.2 20.2,30 19.2,30 18.8,29.6 17,29.6 17,29 17.8,28.2 17.8,26.2 17.6,26 16.2,26 16,25.8 16,24.2 15.6,23.8 10.6,23.8 10.2,23.4 10.2,20.8
VSOLAR
  pour Top (no thermals): 20.4,11.4 22.6,11.4 23,11 23,8.2 20.2,5.4 16.2,5.4 15.8,5.8 15.8,7.8 16.4,8.4 18.4,8.4 19.8,9.8 19.8,11 20.2,11.4
VSYS  (via drill 0.3)
  Top 0.2: 5.98,25.18 C4.1 6.15,25.05 | D2.A 11,25.2 | R7.2 8.72,14.62 IC2.7 8.72,17.48 8.4,17.8 5,17.8 4.6,18.2 | IC1.9 11.72,31.52 11.2,31 11.2,30.8 v11,30.6 | 4.75,41.2 L4.1 | IC5.2 9.1,43.5 8.8,43.2
  Top 0.4: IC4.3 8.55,57.15 8.4,57 6.4,57 | C24.1 4.95,56.55 4,55.6 2.4,55.6 1.8,55 1.8,42.8 2.6,42
  Bottom 0.2: v9.6,26.4 11.4,28.2 11.4,30.2 v11,30.6
  other vias: 5.4,36.4 6.6,36.4 7.8,36.4 10.2,36.4 9,36.4 2.8,26.4 4.2,26.4 2.8,25.4 4.2,25.4
  pour Top (no thermals): 2.4,26.8 11.2,26.8 11.6,26.4 11.6,24.6 11.2,24.2 10.4,24.2 9.8,23.6 4.2,23.6 3.2,22.6 3.2,20.4 3.6,20 4.6,20 4.8,19.8 4.8,18 4.2,17.4 4.2,12.8 3.8,12.4 2.4,12.4 2,12.8 2,26.4
  pour Top (no thermals): 2.8,42.6 7,42.6 7.8,43.4 9,43.4 9,42.6 8,42.6 7.4,42 7.4,39 7.8,38.6 10.6,38.6 10.8,38.4 10.8,36.4 10.4,36 5.4,36 5,36.4 5,39.6 4.6,40 2.4,40 2,40.4 2,42.2 2.4,42.6
  pour Top (no thermals): 4.8,59 6.6,59 6.8,58.8 6.8,57 6.6,56.8 5.8,56.8 4.8,55.8 4.4,55.8 4.2,56 4.2,58.8 4.4,59
  pour Bottom: 5.6,37.2 10.6,37.2 10.8,37 10.8,36.4 9.8,35.4 6.6,35.4 4.6,33.4 4.6,25.2 4.2,24.8 2.8,24.8 2.4,25.2 2.4,27.4 2,27.8 2,33.6

### Text on the board
tPlace: S- | S+ | T | B- | B- | B+
bPlace: (c) qyx@krtko.org, CC-BY-SA | tomato-single-cell-1.0.0+20171011
tNames: 3A | 3A